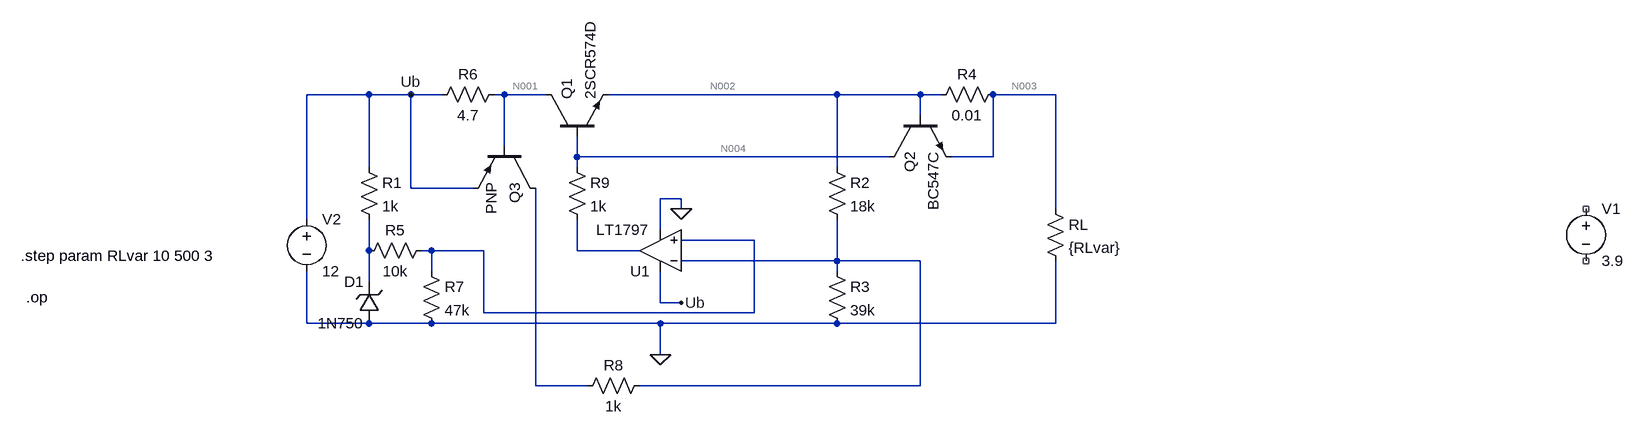
[diagram p0: schematic SerOpTrVorne.asc]
SerOpTrVorne.asc, the LTspice schematic file:
Version 4
SHEET 1 1696 680
WIRE -240 -32 -336 -32
WIRE -176 -32 -240 -32
WIRE -128 -32 -176 -32
WIRE -32 -32 -48 -32
WIRE 32 -32 -32 -32
WIRE 480 -32 128 -32
WIRE 608 -32 480 -32
WIRE 640 -32 608 -32
WIRE 816 -32 720 -32
WIRE 608 0 608 -32
WIRE -32 48 -32 -32
WIRE 80 64 80 32
WIRE 560 64 80 64
WIRE 720 64 720 -32
WIRE 720 64 656 64
WIRE -240 80 -240 -32
WIRE 80 80 80 64
WIRE 480 80 480 -32
WIRE -176 112 -176 -32
WIRE -80 112 -176 112
WIRE 240 128 208 128
WIRE 240 144 240 128
WIRE 816 144 816 -32
WIRE -336 160 -336 -32
WIRE 208 176 208 128
WIRE 352 192 240 192
WIRE -240 208 -240 160
WIRE -144 208 -160 208
WIRE -64 208 -144 208
WIRE 80 208 80 160
WIRE 176 208 80 208
WIRE 480 224 480 160
WIRE 480 224 240 224
WIRE 608 224 480 224
WIRE -144 240 -144 208
WIRE 480 240 480 224
WIRE -240 256 -240 208
WIRE 208 288 208 240
WIRE 240 288 208 288
WIRE -64 304 -64 208
WIRE 352 304 352 192
WIRE 352 304 -64 304
WIRE -336 320 -336 240
WIRE -240 320 -336 320
WIRE -144 320 -240 320
WIRE 208 320 -144 320
WIRE 480 320 208 320
WIRE 816 320 816 224
WIRE 816 320 480 320
WIRE 208 368 208 320
WIRE 16 416 16 112
WIRE 96 416 16 416
WIRE 608 416 608 224
WIRE 608 416 176 416
FLAG 208 368 0
FLAG -176 -32 Ub
FLAG 240 288 Ub
FLAG 240 144 0
SYMBOL Opamps\\LT1797 208 272 R180
SYMATTR InstName U1
SYMBOL voltage -336 144 R0
WINDOW 123 0 0 Left 2
WINDOW 39 0 0 Left 2
SYMATTR InstName V2
SYMATTR Value 12
SYMBOL res -256 64 R0
SYMATTR InstName R1
SYMATTR Value 1k
SYMBOL res 464 64 R0
SYMATTR InstName R2
SYMATTR Value 18k
SYMBOL res 464 224 R0
SYMATTR InstName R3
SYMATTR Value 39k
SYMBOL npn 32 32 R270
SYMATTR InstName Q1
SYMATTR Value 2SCR574D
SYMBOL res 736 -48 R90
WINDOW 0 0 56 VBottom 2
WINDOW 3 32 56 VTop 2
SYMATTR InstName R4
SYMATTR Value 0.01
SYMBOL npn 560 0 M90
SYMATTR InstName Q2
SYMATTR Value BC547C
SYMBOL res 800 128 R0
SYMATTR InstName RL
SYMATTR Value {RLvar}
SYMBOL voltage 1632 128 R0
WINDOW 123 0 0 Left 2
WINDOW 39 0 0 Left 2
SYMATTR InstName V1
SYMATTR Value 3.9
SYMBOL res -32 -48 R90
WINDOW 0 0 56 VBottom 2
WINDOW 3 32 56 VTop 2
SYMATTR InstName R6
SYMATTR Value 4.7
SYMBOL res 192 400 R90
WINDOW 0 0 56 VBottom 2
WINDOW 3 32 56 VTop 2
SYMATTR InstName R8
SYMATTR Value 1k
SYMBOL res 64 64 R0
SYMATTR InstName R9
SYMATTR Value 1k
SYMBOL pnp 16 48 R90
SYMATTR InstName Q3
SYMBOL zener -224 320 R180
WINDOW 0 24 64 Left 2
WINDOW 3 24 0 Left 2
SYMATTR InstName D1
SYMATTR Value 1N750
SYMBOL res -144 192 R90
WINDOW 0 0 56 VBottom 2
WINDOW 3 32 56 VTop 2
SYMATTR InstName R5
SYMATTR Value 10k
SYMBOL res -160 224 R0
SYMATTR InstName R7
SYMATTR Value 47k
TEXT -768 280 Left 2 !.op
TEXT -776 216 Left 2 !.step param RLvar 10 500 3

The netlist it stands for:
* SerOpTrVorne.asc
XU1 N005 N008 Ub 0 N007 LT1797  ; pins In+ In- V+ V- OUT
V2 Ub 0 12
R1 Ub N006 1k
R2 N002 N008 18k
R3 N008 0 39k
Q1 N001 N004 N002 0 2SCR574D
R4 N003 N002 0.01
Q2 N004 N002 N003 0 BC547C
RL N003 0 {RLvar}
V1 NC_01 NC_02 3.9
R6 N001 Ub 4.7
R8 N008 N009 1k
R9 N004 N007 1k
Q3 N009 N001 Ub 0 PNP
D1 0 N006 1N750
R5 N005 N006 10k
R7 N005 0 47k
.model D D
.lib standard.dio
.model NPN NPN
.model PNP PNP
.lib standard.bjt
.op
.step param RLvar 10 500 3
.backanno
.end

* Results of the author's LTspice run, read from the files saved beside the schematic
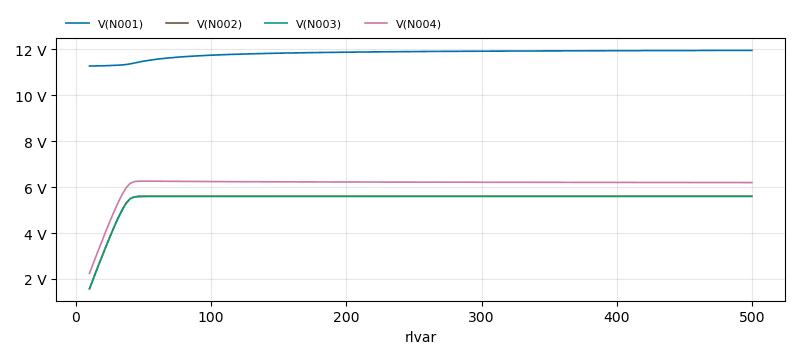
[diagram p1: Operating Point of SerOpTrVorne.asc, plotted from the saved traces]
* Operating Point, 1 run:
*   V(N001): 11.26 V at rlvar=10 , 11.95 V at rlvar=500 , min 11.26 V, max 11.95 V
*   V(N002): 1.574 V at rlvar=10 , 5.597 V at rlvar=500 , min 1.574 V, max 5.597 V
*   V(N003): 1.573 V at rlvar=10 , 5.597 V at rlvar=500 , min 1.573 V, max 5.597 V
*   V(N004): 2.246 V at rlvar=10 , 6.195 V at rlvar=500 , min 2.246 V, max 6.257 V
* From the log:
*   Semiconductor Device Operating Points:
*                           --- Diodes ---
*   Name:      d1        d:u1:3      d:u1:16     d:u1:15     d:u1:14
*   Model:    1n750     u1:dbia2    u1:dbia2     u1:din     u1:dlimp2
*   Id:     -7.27e-03    1.04e-07    1.04e-07    7.78e-11    1.31e-09
*   Vd:     -4.65e+00    7.07e+00    7.07e+00    2.57e-05    4.89e-01
*   Req:     7.62e+00    1.00e-03    1.00e-03    3.03e-06    5.56e-09
*   CAP:     5.91e-11    0.00e+00    0.00e+00    0.00e+00    0.00e+00
*   Name:    d:u1:7      d:u1:13     d:u1:12     d:u1:6      d:u1:11
*   Model:    u1:dp     u1:dbiaot   u1:dbiaot   u1:dlimn2   u1:dbia1
*   Id:      1.00e-04   -8.25e-12   -8.25e-12    2.66e-10   -3.54e-08
*   Vd:      1.20e+01   -8.17e+00   -8.17e+00    3.76e-01   -7.07e+00
*   Req:     1.00e-03    1.00e-14    1.00e-14    1.25e-09    5.00e-09
*   CAP:     0.00e+00    0.00e+00    0.00e+00    0.00e+00    0.00e+00
*   Name:    d:u1:10     d:u1:8      d:u1:5      d:u1:1      d:u1:4
*   Model:  u1:dbia1    u1:dlimp1   u1:dlimn1   u1:dvlimu   u1:dbia3
*   Id:     -3.54e-08    4.89e-10    3.80e-11    9.67e-04    6.95e-04
*   Vd:     -7.07e+00    4.89e-01    3.76e-01    5.57e-02    1.10e+00
*   Req:     5.00e-09    1.00e-09    1.00e-10    1.00e-01    1.00e-03
*   CAP:     0.00e+00    0.00e+00    0.00e+00    0.00e+00    0.00e+00
*                           --- Bipolar Transistors ---
*   Name:       q3          q2          q1
*   Model:      pnp       bc547c     2scr574d
*   Ib:      -2.23e-06   -6.97e-13    6.71e-04
*   Ic:      -2.23e-04    7.49e-13    1.56e-01
*   Vbe:     -7.35e-01    1.57e-03    6.71e-01
*   Vbc:      7.21e+00   -6.71e-01   -9.02e+00
*   Vce:     -7.94e+00    6.73e-01    9.69e+00
*   BetaDC:   1.00e+02   -1.08e+00    2.33e+02
*   Gm:       8.64e-03    1.93e-12    5.92e+00
*   Rpi:      1.16e+04    9.33e+11    3.88e+01
*   Rx:       0.00e+00    1.00e+00    1.49e+00
*   Ro:         NaN       1.06e+15    7.10e+02
*   Cbe:      0.00e+00    1.23e-11    3.76e-09
*   Cbc:      0.00e+00    1.82e-12    1.99e-11
*   Cjs:      0.00e+00    0.00e+00    0.00e+00
*   BetaAC:   1.00e+02    1.80e+00    2.29e+02
*   Cbx:      0.00e+00    1.12e-12    0.00e+00
*   Ft:       0.00e+00    1.67e-02    2.49e+08
*                           --- VDMOSFET Transistors ---
*   Name:        m:u1:2      m:u1:1
*   Model:        u1:pi       u1:ni
*   Id:         -9.67e-04    2.96e-04
*   Vgs:        -4.33e-01    3.76e-01
*   Vds:        -9.03e+00    2.92e+00
*   Vth:        -3.00e-01    3.00e-01
*   Gm:          1.45e-02    7.81e-03
*   Gds:         8.87e-06    2.88e-06
*   Cgs:         0.00e+00    0.00e+00
*   Cgd:         0.00e+00    0.00e+00
*   Cbody:       0.00e+00    0.00e+00